# EAGLE design v1 (EAGLE 9.4.2)
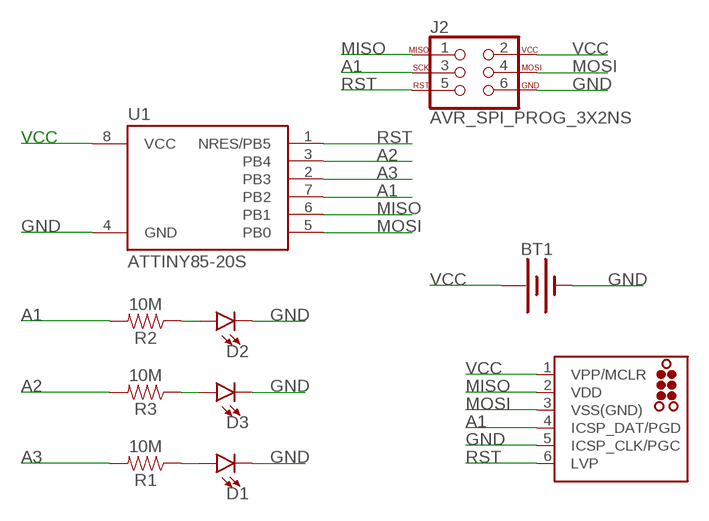
[diagram p0: schematic, sheet 1]

## Parts
BT1  BATTERY-20MM_SMD  [BATTCON_20MM]
D1  LED5MM  [LED_5MM]
D2  LED5MM  [LED_5MM]
D3  LED5MM  [LED_5MM]
J1  TC2030-MCP-NL  [TC2030-MCP-NL]
J2  AVR_SPI_PROG_3X2NS  [2X3-NS]
R1  10M  10MOHM-HORIZ-1/4W-5%  [AXIAL-0.3]
R2  10M  10MOHM-HORIZ-1/4W-5%  [AXIAL-0.3]
R3  10M  10MOHM-HORIZ-1/4W-5%  [AXIAL-0.3]
U1  ATTINY85-20S  [SOIC8_EIAJ_208MIL]

## Nets
A1: J1.4(ICSP_DAT/PGD) J2.3 R2.P$2 U1.7(PB2)
A2: R3.P$2 U1.3(PB4)
A3: R1.P$2 U1.2(PB3)
GND: BT1.2(-) D1.K(C) D2.K(C) D3.K(C) J1.5(ICSP_CLK/PGC) J2.6 U1.4(GND)
MISO: J1.2(VDD) J2.1 U1.6(PB1)
MOSI: J1.3(VSS(GND)) J2.4 U1.5(PB0)
N$1: D1.A R1.P$1
N$4: D2.A R2.P$1
N$5: D3.A R3.P$1
RST: J1.6(LVP) J2.5 U1.1(NRES/PB5)
VCC: BT1.1(+) J1.1(VPP/MCLR) J2.2 U1.8(VCC)

## Library data of the parts
BT1 = SparkFun-Batteries:BATTERY: Battery - Single Cell A variety of battery chemistries, sizes, and footprints. Device List: 20MM_PTH - Coin Cell Battery Holder - 20mm (PTH) <https://www.sparkfun.com/products/783> 20MM_PTH_KIT- Coin Cell battery Holder - 20 mm (PTH) <http://www.sparkfun.com/products/783>kit version with special mask 6.8MM_PTH - Coin Cell Battery Holder - 6.8MM(SMD) <https://www.digikey.com/product-detail/en/seiko-instruments/MS621FE-FL11E/728-1057-ND/1889208?WT.srch=1&gclid=CNOQ5a6LzdQCFZS2wAodXCkE0g> 12MM_SMD - Coin Cell Battery Holder - 12mm (SMD) <https://www.sparkfun.com/products/10592> 12MM_PTH - Coin Cell Battery Holder - 12mm (PTH) <https://www.sparkfun.com/products/7948> 20MM_SMD - 20mm Coin Cell Battery Holder (SMD) (2 legs) Used on the Big Time Watch Kit <https://www.sparkfun.com/products/11734> 20MM_SMD_4LEGS - Coin Cell Battery Holder - 20mm (SMD) <https://www.sparkfun.com/products/11892> 20MM_SMD_4LEGS_OVERPASTE - Coin Cell Battery Holder - 20mm (SMD) <https://www.sparkfun.com/products/11892> (Over-paste on the legs) 24.5MM_PTH - Coin Cell Battery Holder - 24.5mm (PTH) <https://www.sparkfun.com/products/8863> 9V - 9V Battery Holder - PC Mount Used on the SparkFun SparkPunk Sound Kit <https://www.sparkfun.com/products/11177> and SparkFun SparkPunk Sequencer Kit <https://www.sparkfun.com/products/12707> 18650 - Battery Holder - 18650 (PTH) <https://www.sparkfun.com/products/13113> AA - Battery Holder - 1xAA (PTH) <https://www.sparkfun.com/products/7949> AAA - Battery Holder - 1xAAA (PTH) <https://www.sparkfun.com/products/12718> AA_KIT - Battery Holder - 1xAA (PTH) <https://www.sparkfun.com/products/7949> Special kit package - pads only have exposed copper on one side of the board. AAA_KIT - Battery Holder - 1xAAA (PTH) <https://www.sparkfun.com/products/12718> Special kit package - pads only have exposed copper on one side of the board.; PROD_ID: BATT-11519
D1-D3 = SparkFun-LED:LED: LED (Generic) Standard schematic elements and footprints for 5mm, 3mm, 1206, and 0603 sized LEDs. Generic LEDs with no color specified.
J1 = tag-connect:TC2030: TAG-CONNECT ICSP Connector Manufacturer: Tag-Connect <http://www.tag-connect.com> Cable for easy In-Circuit Serial Programming. Designed for Microchip ICD2, suitable for many others. Two variants - one "with legs" (for hands-free fit on PCB) and another "without legs" for quick programming. PAD Description 1 MCLR/Vpp 2 Vdd 3 GND 4 PGD (ISPDAT) 5 PGC (ISPCLK) 6 nc (used for LVP) ©2009 ROFA.cz - modified and updated by Robert Darlington ‹rdarlington@gmail.com›
J2 = SparkFun-Connectors:AVR_SPI_PROG_3X2: AVR ISP 6 Pin This is the reduced ISP connector for AVR programming. Common on Arduino. This footprint will take up less PCB space and can be used with a 10-pin to 6-pin adapter such as SKU: BOB-08508 **Special note about "TEST_POINT" package. The stop mask is on the top side, so if you want your programming test points to be on the bottom of your board, make sure to place this package on the bottom side of the board. This also ensure that the orientation to program from the bottom side will be correct. SparkFun Products: SparkFun ISP Pogo Adapter <https://www.sparkfun.com/products/11591> - NS Tiny AVR Programmer <https://www.sparkfun.com/products/11801> -PTH
R1-R3 = SparkFun-Resistors:10MOHM: RES-09327; PROD_ID: RES-09327
U1 = _hhn_attiny25_45_85:ATTINY85*: ATMEL ATtiny 85 Packages: P = PDIP 08 30mil S = SOIC 08 EIAJ 208mil Technologies Note: for complete ordering code (temp. range, finish, tape&reel etc.) see www.atmel.com • Supply Voltage: V = (1.8…5.5)V | [blank] = (2.7…5.5)V • Speed: 10 = 10 MHz | 20 = 20 MHz Author: Dipl.-Ing. FH Rainer Bayer HHN Hochschule Heilbronn (Heilbronn University), rainer.bayer@hs-heilbronn.de Ingenieurbüro ing-rb, mail@ing-rb.de

## Board
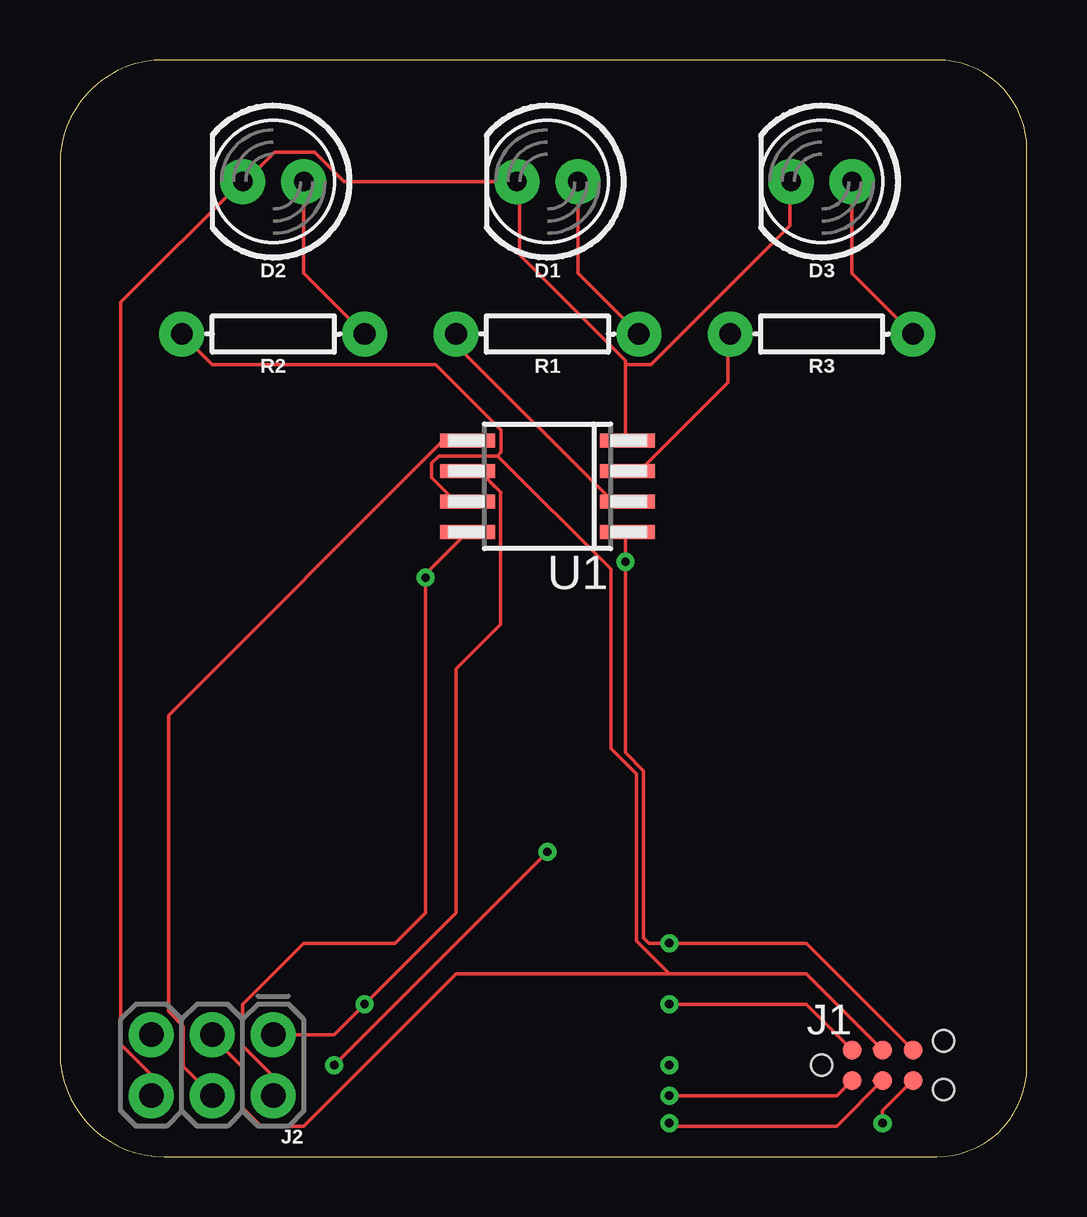
[diagram p1: board, top side]
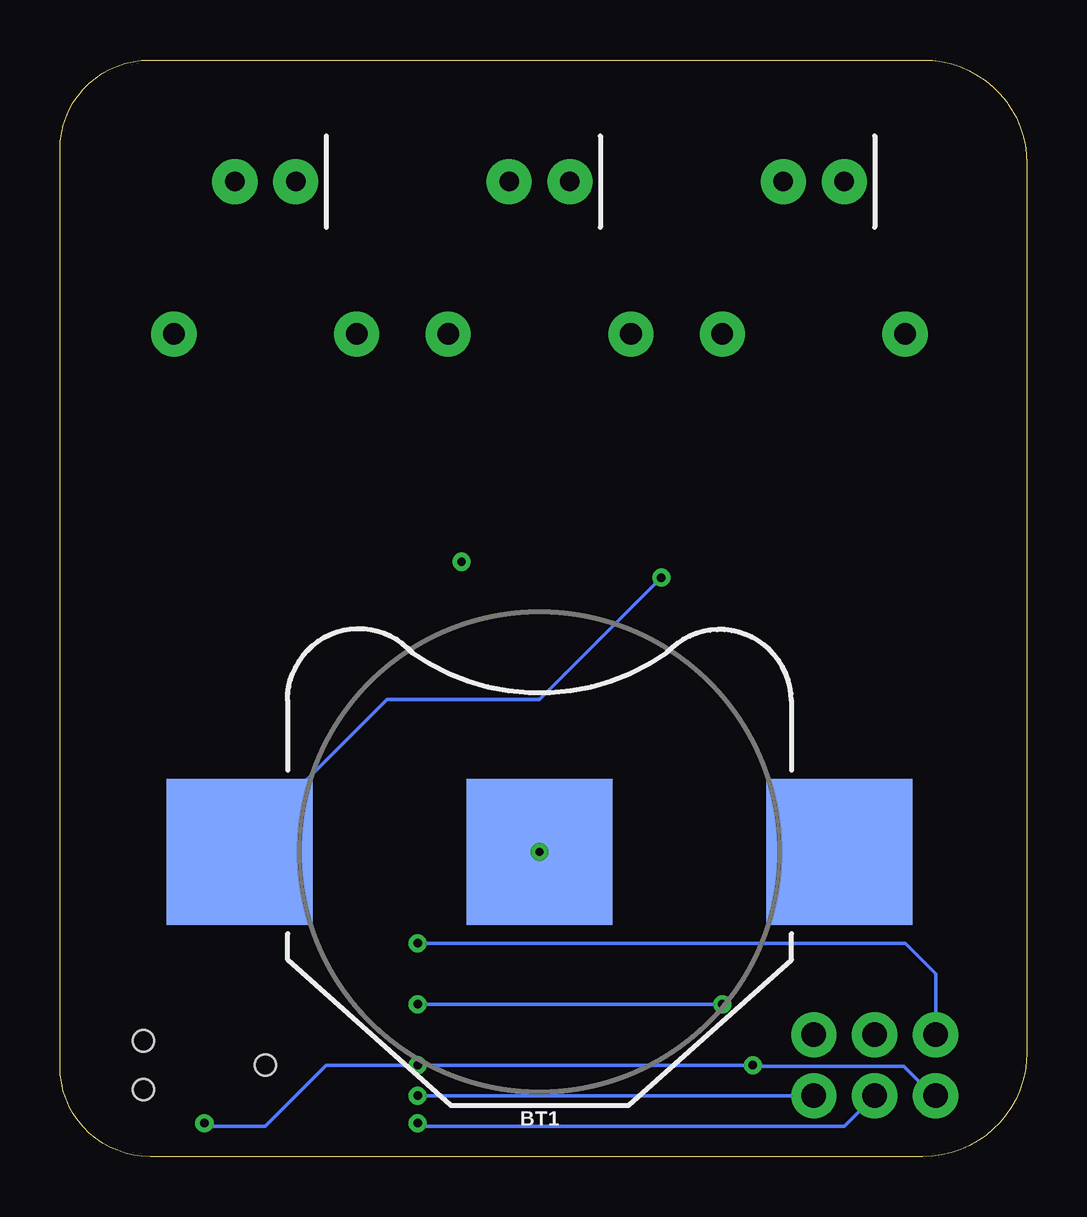
[diagram p2: board, bottom side, seen from below]

Size 40.31 x 45.71 mm. Coordinates in mm from the lower left corner, seen from the top.
Outline: 40.31,3.75 40.31,41.97 arc90 36.57,45.71 4.32,45.71 arc90 0,41.39 0,4.34 arc90 4.34,0 36.55,0 arc90 40.31,3.75
Copper layers (1*16): Top 0.035mm / dielectric 1.5mm / Bottom 0.035mm
Design rules "default": minimum track width 6mil, minimum drill 0.35mm, track to track 6mil, track to pad 6mil, pad to pad 6mil, via to via 6mil, smd to smd 6mil, copper to edge 40mil, drill to drill 6mil, minimum pad ring 10mil, minimum via ring 8mil, stop-mask expansion 4mil, vias tented up to drill 0mil, thermal gap 10mil

### Footprints (pad centres in the part's own frame; a part is rotated, then mirrored left to right if it is on the bottom)
BATTCON_20MM = smd 6.07 x 6.07: 1 -12.5,0; 2 0,0; 3 12.5,0
LED_5MM = drill 0.813 pad 1.88: A -1.27,0; K 1.27,0
TC2030-MCP-NL = smd 0.787 x 0.787: 1 1.27,-0.635; 2 1.27,0.635; 3 2.54,-0.635; 4 2.54,0.635; 5 3.81,-0.635; 6 3.81,0.635 | hole 0.889: 0,0; 5.08,-1.016; 5.08,1.016
2X3-NS = drill 1.016 pad 1.88: 1 -2.54,-1.27; 2 -2.54,1.27; 3 0,-1.27; 4 0,1.27; 5 2.54,-1.27; 6 2.54,1.27
AXIAL-0.3 = drill 0.9 pad 1.88: P$1 -3.81,0; P$2 3.81,0
SOIC8_EIAJ_208MIL = smd 0.6 x 2.286: 1 -1.905,-3.33; 2 -0.635,-3.33; 3 0.635,-3.33; 4 1.905,-3.33; 5 1.905,3.33; 6 0.635,3.33; 7 -0.635,3.33; 8 -1.905,3.33

### Placement (x,y rotation side)
BT1  20.32,12.7 0 bottom
D1  20.32,40.64 180 top
D2  8.89,40.64 180 top
D3  31.75,40.64 180 top
J1  31.75,3.81 0 top
J2  6.35,3.81 180 top
R1  20.32,34.29 180 top
R2  8.89,34.29 180 top
R3  31.75,34.29 180 top
U1  20.32,27.94 90 top

### Tracks (layer width: path | path; a pad name or v marks a point on that pad's centre or on a via)
A1
  Top 0.152: 18.24,29.21 15.8,29.21 15.49,28.91 15.49,28.3 16.41,27.38 16.87,27.38 U1.7 | 18.24,29.21 18.39,29.36 18.39,30.28 15.65,33.02 6.35,33.02 R2.P$2 | 33.93,4.52 34.24,4.52 J1.4 31.12,7.62 25.4,7.62 | J2.3 6.35,4.98 7.57,3.76 7.57,2.08 8.38,1.27 10.16,1.27 16.51,7.62 25.4,7.62 | 18.24,29.21 22.96,24.49 22.96,17.02 24.03,15.95 24.03,8.99 25.4,7.62
A2
  Top 0.152: U1.3 23.72,28.6 24.18,28.6 27.84,32.26 27.84,34.24 R3.P$2
A3
  Top 0.152: U1.2 23.57,27.38 22.96,27.38 16.56,33.78 16.56,34.24 R1.P$2
GND  (via drill 0.35)
  Top 0.152: 23.57,33.02 23.57,33.17 19.15,37.59 19.15,40.64 D1.K 11.84,40.64 10.62,41.86 8.94,41.86 7.72,40.64 D2.K 7.57,40.64 2.54,35.61 2.54,4.67 3.76,3.45 3.76,2.54 J2.6 | 23.57,33.02 23.57,29.97 U1.4 | 23.57,33.02 24.64,33.02 30.43,38.81 30.43,40.64 D3.K | J1.5 34.29,1.9 v34.29,1.39 | v11.43,3.81 BT1.2
  Bottom 0.152: 20.22,12.75 BT1.2 22.86,10.16 | J2.6 3.91,2.54 5.13,3.76 11.38,3.76 v11.43,3.81 v25.4,3.81 29.21,3.81 31.75,1.27 34.17,1.27 v34.29,1.39
  other vias: 20.32,12.7
MISO  (via drill 0.35)
  Top 0.152: 17.96,28.12 17.63,28.45 17.02,28.45 U1.6 | 17.96,28.12 18.39,27.69 | J1.2 31.12,6.35 v25.4,6.35 | J2.1 11.43,5.08 v12.7,6.35 16.51,10.16 16.51,20.32 18.36,22.17 18.36,27.7 17.96,28.1 17.96,28.12
  Bottom 0.152: v25.4,6.35 v12.7,6.35
MOSI  (via drill 0.35)
  Top 0.152: 33.93,3.15 34.24,3.15 J1.3 32.38,1.27 25.52,1.27 v25.4,1.39 | J2.4 5.13,3.76 5.13,5.44 4.52,6.04 4.52,18.39 15.95,29.82 16.87,29.82 U1.5
  Bottom 0.152: v25.4,1.39 25.4,1.27 7.62,1.27 J2.4
N$1
  Top 0.152: D1.A 21.59,36.83 R1.P$1
N$4
  Top 0.152: D2.A 10.16,36.83 R2.P$1
N$5
  Top 0.152: D3.A 33.02,36.83 R3.P$1
RST  (via drill 0.35)
  Top 0.152: U1.1 23.57,26.01 v23.57,24.79 23.57,16.84 24.33,16.08 24.33,9.12 24.56,8.89 v25.4,8.89 31.12,8.89 J1.6
  Bottom 0.152: 3.91,5.13 J2.5 3.81,7.62 5.08,8.89 v25.4,8.89
VCC  (via drill 0.35)
  Top 0.152: J2.2 8.79,2.54 8.79,3.45 7.62,4.62 7.62,6.35 10.16,8.89 13.97,8.89 15.24,10.16 v15.24,24.13 15.24,24.28 U1.8 | J1.1 32.38,2.54 v25.4,2.54
  Bottom 0.152: J2.2 v25.4,2.54 | v15.24,24.13 20.32,19.05 26.67,19.05 30.48,15.24 30.48,15.04 BT1.1